# Altium schematic sheet Current Sense.SchDoc
size Letter; DocumentNumber: 3; SheetNumber: 3; SheetTotal: 7
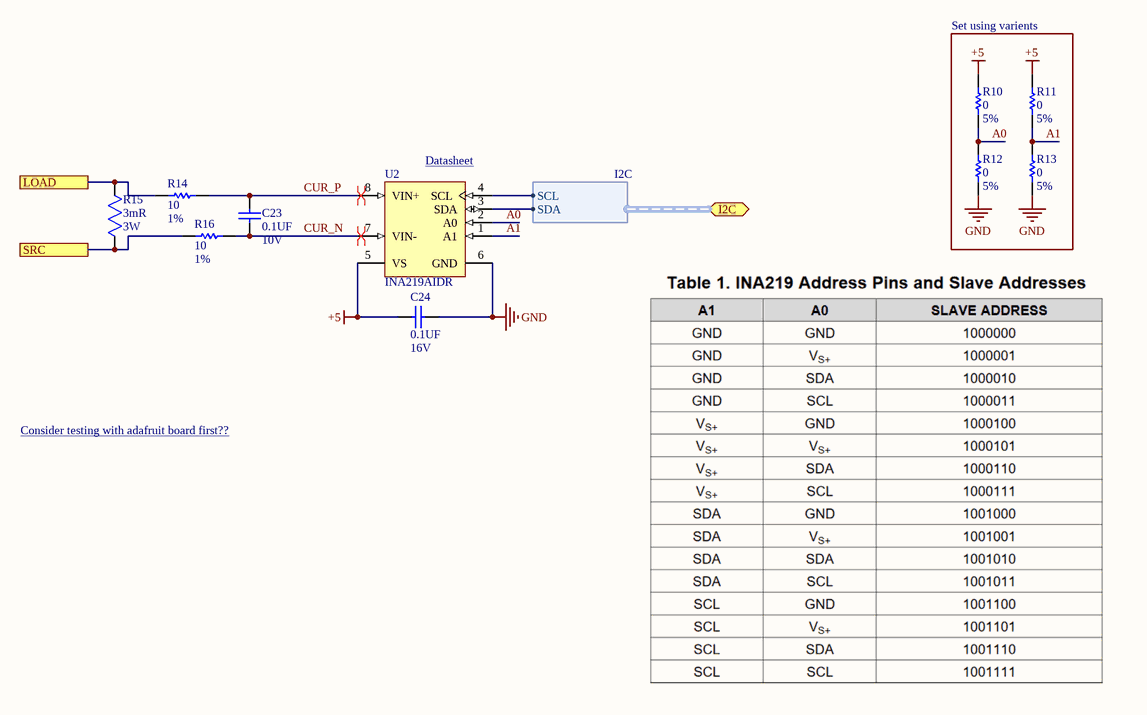
[diagram p0: Current Sense.SchDoc]

## Parts
C23  Val: 0.1UF  Vol: 10V  [0603_CAP]  (hidden comment: CAP 0603 0.1UF 10V 10% X7R)
C24  Val: 0.1UF  Vol: 16V  [0603_CAP]  (hidden comment: CAP 0603 0.1UF 16V 10% X7R)
R10  Val: 0  Tol: 5%  [0603_RES]  (hidden comment: RES 0603 0 5%)
R11  Val: 0  Tol: 5%  [0603_RES]  (hidden comment: RES 0603 0 5%)
R12  Val: 0  Tol: 5%  [0603_RES]  (hidden comment: RES 0603 0 5%)
R13  Val: 0  Tol: 5%  [0603_RES]  (hidden comment: RES 0603 0 5%)
R14  Val: 10  Tol: 1%  [0603_RES]  (hidden comment: RES 0603 10 1%)
R15  Resistance: 3mR  Power Rating: 3W  [RES_6432-M]  (hidden comment: KRL6432E-M-R003-F-T1)
R16  Val: 10  Tol: 1%  [0603_RES]  (hidden comment: RES 0603 10 1%)
U2  INA219AIDR  [D0008A_N]

## Blocks framed on the sheet
Set using varients: R10-R13

## Ports
I2C (bidir, harness I2C), LOAD, SRC

## Harnesses
I2C: SCL, SDA

## Nets
+5: C24.1 R10.2 R11.2 U2.5(VS)
GND: C24.2 R12.1 R13.1 U2.6(GND)
A0: R10.1 R12.2 U2.2(A0)
A1: R11.1 R13.2 U2.1(A1)
CUR_N: C23.1 R16.2 U2.7(VIN-)
CUR_P: C23.2 R14.2 U2.8(VIN+)
LOAD: R14.1 R15.2 ; port LOAD
SRC: R15.1 R16.1 ; port SRC
NetU2_3: U2.3(SDA) ; port I2C.SDA
NetU2_4: U2.4(SCL) ; port I2C.SCL

## Layout directives
differential pair: CUR_N, CUR_P

## Notes on the sheet
- (near U2) Datasheet <http://www.ti.com/lit/ds/symlink/ina219.pdf>
- Consider testing with adafruit board first?? <https://www.adafruit.com/product/904>
- Title:
- Size:
- Date:
- Desc:
- Letter
- Auth:
- Sheet
- Proj:
- *
- of
- www.uvmaero.org
- File:

## Library data of the parts
C23 = CAP 0603 0.1UF 10V 10% X7R: Capacitor Surface Mount 0603 Footprint 0.1UF 10V 10% Tolerance Ceramic X7R; Manufacturer: Various; PCB Package: 0603; Description in Visual: Cap SMT 0603 0.1UF 10V 10%  Cer X7R; P/N: CAP 0603 0.1UF 10V 10% X7R; Manufacturer P/N: Various; Value: 0.1UF; Voltage: 10V; Tolerance: 10%; Type: Ceramic X7R; ComponentLink1Description: Manufacturer Website; ComponentLink2Description: Component Datasheet; ComponentLink3Description: Octopart Link
C24 = CAP 0603 0.1UF 16V 10% X7R: Capacitor Surface Mount 0603 Footprint 0.1UF 16V 10% Tolerance Ceramic X7R; Manufacturer: Various; PCB Package: 0603; Description in Visual: Cap SMT 0603 0.1UF 16V 10%  Cer X7R; P/N: CAP 0603 0.1UF 16V 10% X7R; Manufacturer P/N: Various; Value: 0.1UF; Voltage: 16V; Tolerance: 10%; Type: Ceramic X7R; ComponentLink1Description: Manufacturer Website; ComponentLink2Description: Component Datasheet; ComponentLink3Description: Octopart Link
R10-R13 = RES 0603 0 5%: Resistor Surface Mount, 0 Ohms, 0603 Footprint, 5% Tolerance 0.1W; Manufacturer: Various; PCB Package: 0603; Description in Visual: Res SMT 0 0603  5%  0.1W; Value: 0; P/N: RES 0603 0 5%; Manufacturer P/N: Various; Power_Rating: 0.1W; Tolerance: 5%
R14 R16 = RES 0603 10 1%: Resistor Surface Mount, 10 Ohms, 0603 Footprint, 1% Tolerance 0.1W; Manufacturer: Various; PCB Package: 0603; Description in Visual: Res SMT 10 0603  1%  0.1W; Value: 10; P/N: RES 0603 10 1%; Manufacturer P/N: Various; Power_Rating: 0.1W; Tolerance: 1%
R15 = KRL6432E-M-R003-F-T1: 3 mOhms ±1% 3W Chip Resistor Wide 2512 (6432 Metric), 1225 Automotive AEC-Q200, Current Sense Metal Foil; Manufacturer: Susumu; Temperature Coefficient: 50ppm/°C; Width: 3.1mm; Case Code (Imperial): 2512; Case Code (Metric): 6432; Case/Package: 2512; Category: Chip SMD Resistors; Composition: Metal Foil; Height: 0.5mm; Length: 6.3mm; Manufacturer Part Number: KRL6432E-M-R003-F-T1; Max Operating Temperature: 155°C; Min Operating Temperature: -55°C; Package Quantity: 1000; Packaging: Tape and Reel; Termination: SMD/SMT; Tolerance: 1%; Weight: 0.001429oz; Supplier 1: Digi-Key; Supplier Part Number 1: 408-1613-1-ND
U2 = INA219AIDR: Zero-Drift, Bi-Directional Current / Power Monitor, 3 to 5.5 V, -40 to 125 degC, 8-pin SOIC (D8), Green (RoHS & no Sb/Br); Manufacturer: Texas Instruments; Common Mode Range(Min)(V): 0; SubFamily: Current Shunt Monitor; Rating: Catalog; Input Offset (+/-)(Max)(uV): 100; Vs(Max)(V): 5.5; Common Mode Range(Max)(V): 26; Quiescent Current (+/-)(Typ)(mA): 0.7; Vs(Min)(V): 3; Gain(V/V): 1, 0.5, 0.25, 0.125; Small-Signal Bandwidth(Typ)(MHz): 0.011; PackageReference: D0008A; ComponentLink1URL: http://www.ti.com/; Eco-Plan: Green (RoHS & no Sb/Br); ComponentLink2URL: http://www.ti.com/general/docs/lit/getliterature.tsp?genericPartNumber=INA219&fileType=pdf; ComponentLink1Description: Manufacturer URL; ComponentLink3Description: Package Specification; Mounting Technology: Surface Mount; PackageDescription: 8-Pin Plastic Small Outline, Body 4.9 x 3.9 mm, Pitch 1.27 mm; ComponentLink3URL: http://www.ti.com/lit/ml/msoi002j/msoi002j.pdf; DatasheetVersion: SBOS448F; PackageVersion: 4040047-3/M, 06/2011; PartNumber: INA219AIDR; Code_JEDEC: MS-012; ComponentLink2Description: Datasheet; CMRR(Min)(dB): 100; Supplier 1: Digi-Key; Supplier Part Number 1: 296-23978-1-ND